# EAGLE design internet-points-signal (EAGLE 6.3)
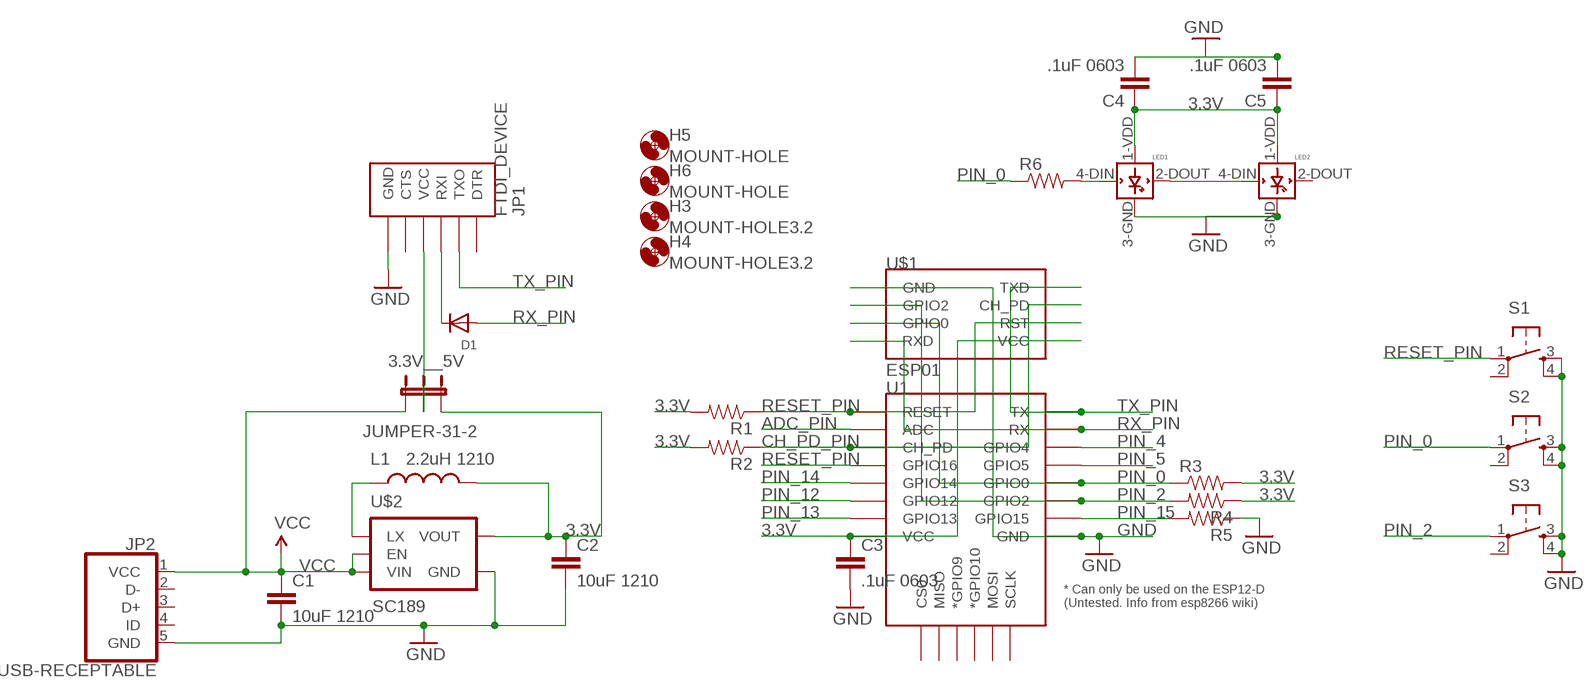
[diagram p0: schematic, sheet 1]

## Parts
3.3V__5V  JUMPER-31-2  [SJ_3_PASTE1&2]
C1  10uF 1210  10UF50V20%(1210)  [1210]
C2  10uF 1210  10UF50V20%(1210)  [1210]
C3  .1uF 0603  CAP0603-CAP  [0603-CAP]
C4  .1uF 0603  CAP0603-CAP  [0603-CAP]
C5  .1uF 0603  CAP0603-CAP  [0603-CAP]
D1  DIODESOD-323F  [SOD-323F]
H3  MOUNT-HOLE3.2  [3,2]
H4  MOUNT-HOLE3.2  [3,2]
H5  MOUNT-HOLE  [3,2-DANGER]
H6  MOUNT-HOLE  [3,2-DANGER]
JP1  FTDI_DEVICE  [FTDI_DEVICE_SIDE]
JP2  USB-RECEPTABLE  [FCI-10103594-0001LF]
L1  2.2uH 1210  INDUCTOR1210  [1210]
LED1  WS2812B  [WS2812B]
LED2  WS2812B  [WS2812B]
R1  RESISTOR0603-RES  [0603-RES]
R2  RESISTOR0603-RES  [0603-RES]
R3  RESISTOR0603-RES  [0603-RES]
R4  RESISTOR0603-RES  [0603-RES]
R5  RESISTOR0603-RES  [0603-RES]
R6  RESISTOR0603-RES  [0603-RES]
S1  TAC_SWITCHSMD  [TACTILE_SWITCH_SMD]
S2  TAC_SWITCHSMD  [TACTILE_SWITCH_SMD]
S3  TAC_SWITCHSMD  [TACTILE_SWITCH_SMD]
U1  ESP12ESMD  [ESP12E-SMD]
U$1  ESP01  [ESP01]
U$2  SC189  [SOT23-5]

## Nets
3.3V: 3.3V__5V.3 C2.1 C3.1 C4.1 C5.1 L1.2 LED1.1-VDD(VDD) LED2.1-VDD(VDD) R1.2 R2.2 R3.2 R4.1 U1.VCC U$1.VCC U$2.4(VOUT)
ADC_PIN: U1.ADC
CH_PD_PIN: R2.1 U1.CH_PD U$1.CH_PD
GND: C1.2 C2.2 C3.2 C4.2 C5.2 JP1.P$6(GND) JP2.5(GND) LED1.3-GND(GND) LED2.3-GND(GND) R5.1 S1.3 S1.4 S2.3 S2.4 S3.3 S3.4 U1.GND U$1.GND U$2.2(GND)
N$1: L1.1 U$2.5(LX)
N$3: D1.C JP1.P$3(RXI)
N$4: 3.3V__5V.2 JP1.P$4(VCC)
N$5: LED1.4-DIN(DIN) R6.2
N$6: LED1.2-DOUT(DOUT) LED2.4-DIN(DIN)
PIN_0: R3.1 R6.1 S2.1 U1.GPIO0 U$1.GPIO0
PIN_2: R4.2 S3.1 U1.GPIO2 U$1.GPIO2
PIN_4: U1.GPIO4
PIN_5: U1.GPIO5
PIN_12: U1.GPIO12
PIN_13: U1.GPIO13
PIN_14: U1.GPIO14
PIN_15: R5.2 U1.GPIO15
RESET_PIN: R1.1 S1.1 U1.GPIO16 U1.RESET U$1.RST
RX_PIN: D1.A U1.RXD0(RX) U$1.RX(RXD)
TX_PIN: JP1.P$2(TXO) U1.TXD0(TX) U$1.TX(TXD)
VCC: 3.3V__5V.1 C1.1 JP2.1(VCC) U$2.1(VIN) U$2.3(EN)
Unconnected: JP1.P$1(DTR) JP1.P$5(CTS) JP2.2(D-) JP2.3(D+) JP2.4(ID) LED2.2-DOUT(DOUT) S1.2 S2.2 S3.2 U1.CS0 U1.GPIO9(*GPIO9) U1.GPIO10(*GPIO10) U1.MISO U1.MOSI U1.SCLK

## Library data of the parts
3.3V__5V = SparkFun-Passives:JUMPER-3
C1 C2 = SparkFun-Capacitors:10UF50V20%(1210): CAP-09824; PROD_ID: CAP-09824; VALUE: 10uF
C3-C5 = SparkFun-Capacitors:CAP: Capacitor Standard 0603 ceramic capacitor, and 0.1" leaded capacitor.
D1 = adafruit:DIODE: Diode SMADIODE - SMA Surface Mount Package 20V 1A Schottky Diode Digikey: 641-1014-6-ND DO-1N4148 - Through Hole Small Current Diode SOD-123 20V 1 A (.5mV Vf) Schottky Diode - Digikey: MBRX120TPMSCT-ND SOD-323 10V 570mA (.38mV Vf, 3ns) Schottky Diode - Digikey: ZLLS410CT-ND SOD-523 30V 30mA Schottky Diode (RB751S-40TE61) - Digikey: RB751S-40TE61CT-ND SOT23-R/W - SOT23 Package (R = Solder Paste/Reflow Ovens, W = Hand-Soldering) BAT54Film 40V 300mA - Digikey: 497-7162-1-ND
H3-H6 = holes:MOUNT-HOLE: MOUNTING HOLE with drill center marker
JP1 = SparkFun-Connectors:FTDI_DEVICE: Connector which mates to FTDI basic or FTDI cable.
JP2 = daspilker:USB-RECEPTABLE: USB Receptable
L1 = SparkFun-Passives:INDUCTOR: Inductors Basic Inductor/Choke - 0603 and 1206. Footprints are not proven and vary greatly between part numbers. SRN6045- 33uH, 20% 1.4A
LED1 LED2 = adafruit:WS2812B
R1-R6 = SparkFun-Passives:RESISTOR: Resistor Basic schematic elements and footprints for 0603, 1206, and PTH resistors.
S1-S3 = SparkFun-Electromechanical:TAC_SWITCH: Momentary Switch Button commonly used for reset or general input. Spark Fun Electronics SKU : COM-00097 SMT- SWCH-08247; PROD_ID: SWCH-08247
U1 = esp8266modules:ESP12E: ESP12E Module
U$1 = esp8266modules:ESP01: ESP8266 Wifi module 01
U$2 = SparkFun-PowerIC:SC189

## Board
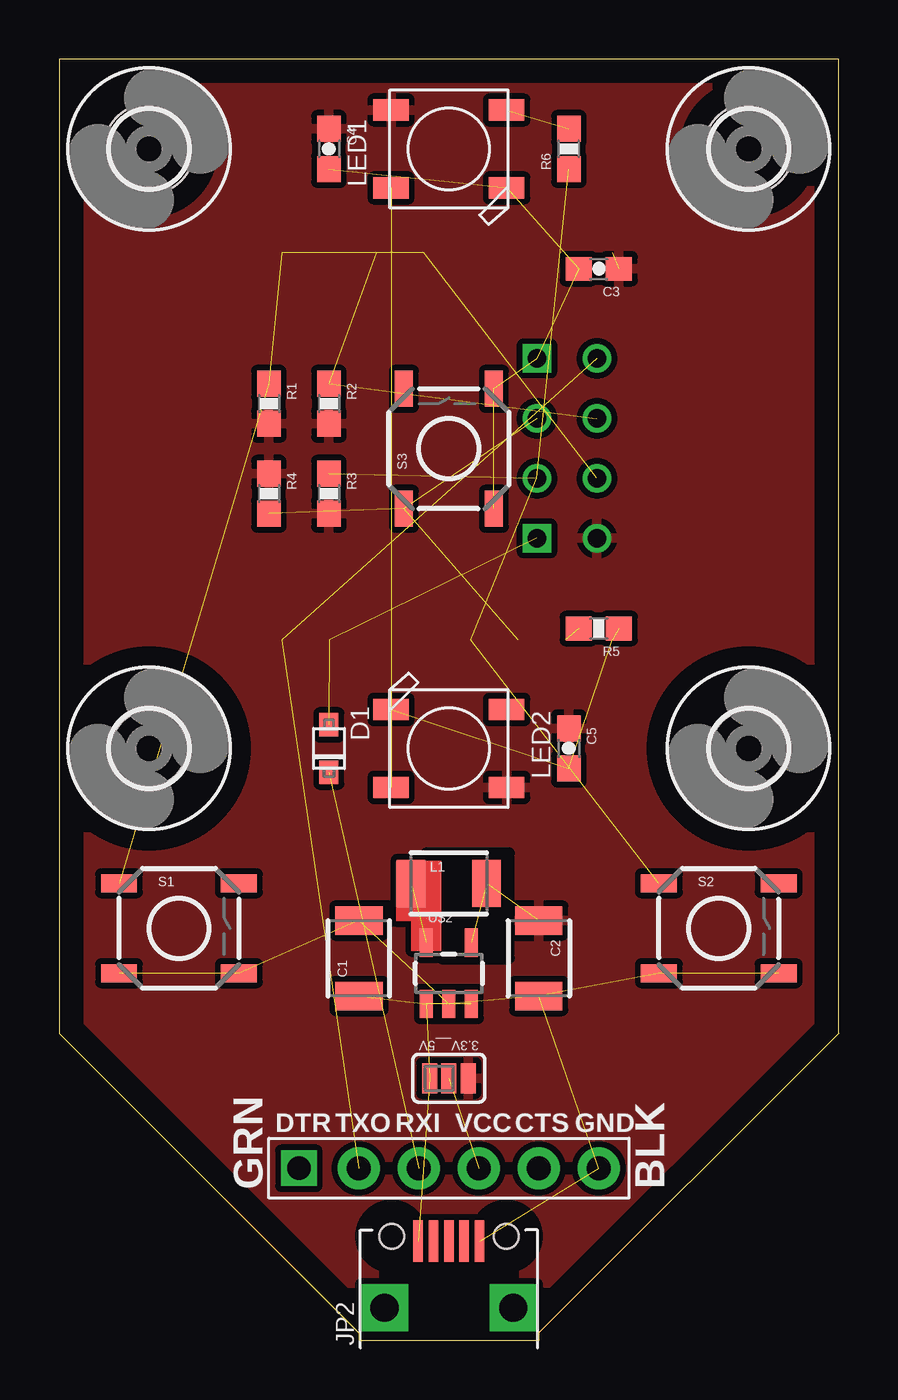
[diagram p1: board, top side]
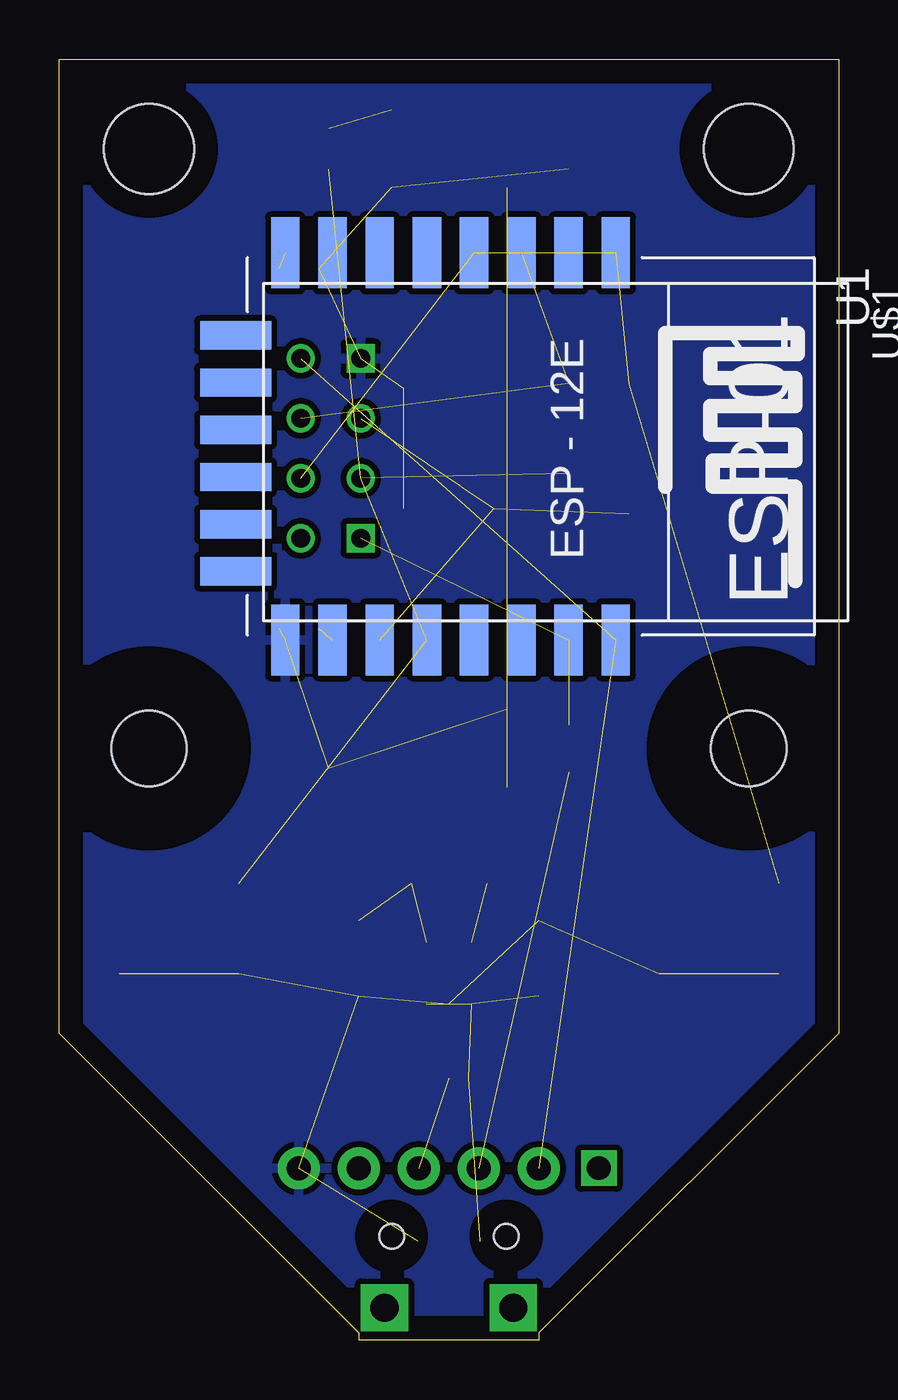
[diagram p2: board, bottom side, seen from below]

Size 33.02 x 54.29 mm. Coordinates in mm from the lower left corner, seen from the top.
Outline: 12.7,0 20.32,0 20.32,0.32 33.02,13.02 33.02,54.29 0,54.29 0,13.02 12.7,0.32 12.7,0
Copper layers (1*16): Top 0.035mm / dielectric 1.5mm / Bottom 0.035mm
Design rules "default *": minimum track width 8mil, minimum drill 13mil, track to track 8mil, track to pad 8mil, pad to pad 8mil, via to via 8mil, smd to smd 8mil, copper to edge 40mil, drill to drill 8mil, minimum pad ring 5mil, minimum via ring 5mil, stop-mask expansion 4mil, vias tented up to drill 15mil, thermal gap 10mil
tRestrict: area 16.2,16.2 to 19.1,18.1; area 15.6,18.1 to 19.1,20.6

### Footprints (pad centres in the part's own frame; a part is rotated, then mirrored left to right if it is on the bottom)
SJ_3_PASTE1&2 = smd 0.635 x 1.27: 1 -0.813,0; 2 0,0; 3 0.813,0
1210 = smd 1.2 x 2: 1 -1.6,0; 2 1.6,0
0603-CAP = smd 1.1 x 1: 1 -0.85,0; 2 0.85,0
SOD-323F = smd 1 x 0.8: A -1,0; C 1,0
3,2 = hole 3.2: 0,0
3,2-DANGER = hole 3.81: 0,0
FTDI_DEVICE_SIDE = drill 1 square: P$1 -6.35,0 | drill 1.016 pad 1.778: P$2 -3.81,0; P$3 -1.27,0; P$4 1.27,0; P$5 3.81,0; P$6 6.35,0
FCI-10103594-0001LF = smd 0.4 x 1.75: 1 -1.3,4.525; 2 -0.65,4.525; 3 0,4.525; 4 0.65,4.525; 5 1.3,4.525 | drill 1.2 pad 2 square: P$3 -2.725,1.7; P$4 2.725,1.7 | hole 1.05: -2.425,4.73; 2.425,4.73
WS2812B = smd 1.5 x 0.9: 1-VDD 2.45,-1.65; 2-DOUT 2.45,1.65; 3-GND -2.45,1.65; 4-DIN -2.45,-1.65
0603-RES = smd 1.1 x 1: 1 -0.85,0; 2 0.85,0
TACTILE_SWITCH_SMD = smd 1.524 x 0.762: 1 -2.54,1.905; 2 2.54,1.905; 3 -2.54,-1.905; 4 2.54,-1.905
ESP12E-SMD = smd 3 x 1.2: ADC -8.3,3.8; CH_PD -8.3,1.8; GND 8.1,-8.2; GPIO0 8.1,-2.2; GPIO2 8.1,-4.2; GPIO4 8.1,-0.2; GPIO5 8.1,1.8; GPIO12 -8.3,-4.2; GPIO13 -8.3,-6.2; GPIO14 -8.3,-2.2; GPIO15 8.1,-6.2; GPIO16 -8.3,-0.2; RESET -8.3,5.8; RXD0 8.1,3.8; TXD0 8.1,5.8; VCC -8.3,-8.2 | smd 1.2 x 3: CS0 -4.8,-10.3; GPIO9 -0.8,-10.3; GPIO10 1.2,-10.3; MISO -2.8,-10.3; MOSI 3.2,-10.3; SCLK 5.2,-10.3
ESP01 = drill 0.8: CH_PD -1.285,-8.178; GPIO0 1.255,-5.638; GPIO2 -1.285,-5.638; RST 1.255,-8.178; TX -3.825,-8.178; VCC 3.795,-8.178 | drill 0.8 square: GND -3.825,-5.638; RX 3.795,-5.638
SOT23-5 = smd 0.55 x 1.2: 1 -0.95,-1.3; 2 0,-1.3; 3 0.95,-1.3; 4 0.95,1.3; 5 -0.95,1.3

### Placement (x,y rotation side)
3.3V__5V  16.51,11.11 0 top
C1  12.7,16.19 90 top
C2  20.32,16.19 270 top
C3  22.86,45.4 180 top
C4  11.43,50.48 270 top
C5  21.59,25.08 270 top
D1  11.43,25.08 270 top
H3  29.21,25.08 0 top
H4  3.81,25.08 0 top
H5  3.81,50.48 0 top
H6  29.21,50.48 0 top
JP1  16.51,7.3 0 top
JP2  16.51,-0.32 0 top
L1  16.51,19.37 0 top
LED1  16.51,50.48 180 top
LED2  16.51,25.08 0 top
R1  8.89,39.69 270 top
R2  11.43,39.69 270 top
R3  11.43,35.88 270 top
R4  8.89,35.88 270 top
R5  22.86,30.16 180 top
R6  21.59,50.48 90 top
S1  5.08,17.46 0 top
S2  27.94,17.46 0 top
S3  16.51,37.78 90 top
U1  15.24,37.78 270 bottom
U$1  14.61,37.78 270 bottom
U$2  16.51,15.56 0 top

### Tracks (layer width: path | path; a pad name or v marks a point on that pad's centre or on a via)
3.3V  (3 unrouted)
  pour Top (isolate 0.254): -1.27,54.29 33.02,54.29 33.02,12.7 20.32,0 13.02,0 0,13.02
CH_PD_PIN  (2 unrouted)
GND  (16 unrouted)
  pour Bottom (isolate 0.254): -1.27,54.29 33.02,54.29 33.02,12.7 20.32,0 13.02,0 0,13.02
N$1  (1 unrouted)
N$3  (1 unrouted)
N$4  (1 unrouted)
N$5  (1 unrouted)
N$6  (1 unrouted)
PIN_0  (4 unrouted)
PIN_2  (3 unrouted)
PIN_15  (1 unrouted)
RESET_PIN  (4 unrouted)
RX_PIN  (2 unrouted)
TX_PIN  (2 unrouted)
VCC  (4 unrouted)
(copper drawn outside any net)
  shapes: Top area x5